# Altium schematic sheet _074_GSENSOR_KEY.SchDoc
size A1; SheetNumber: 1; SheetTotal: 1
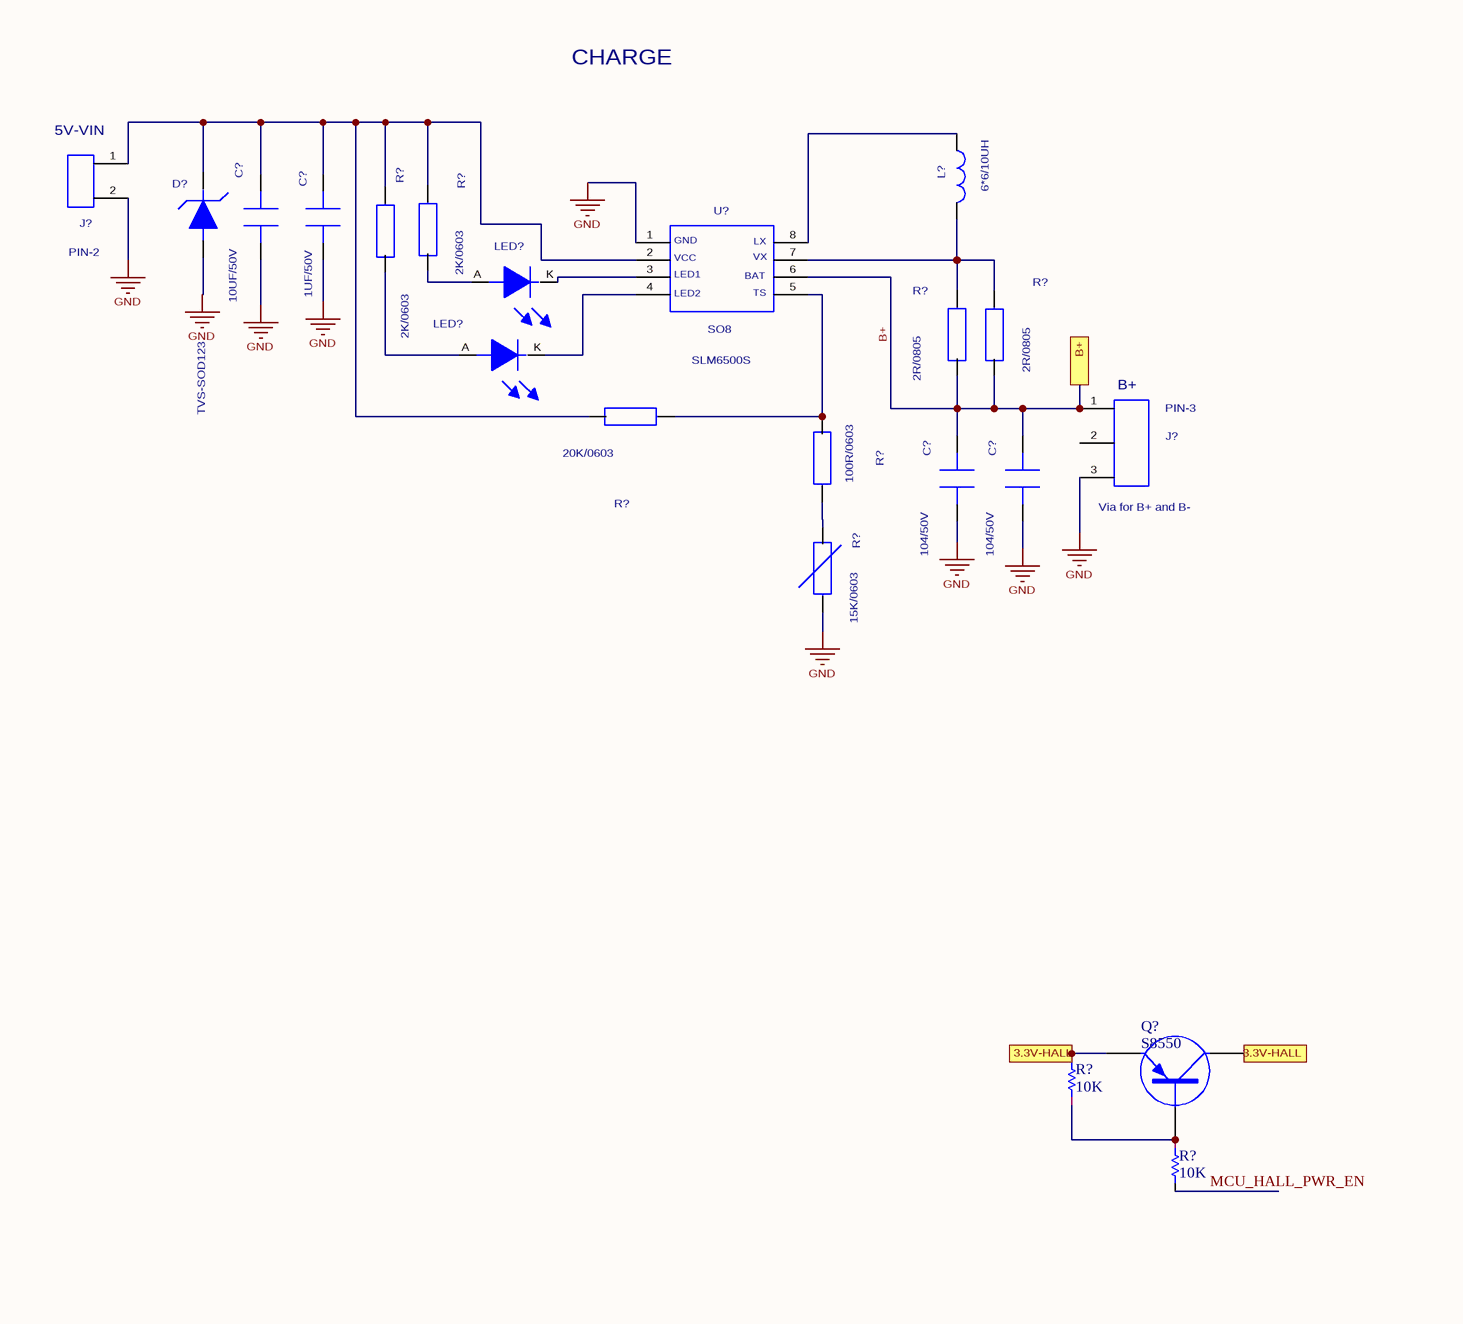
[diagram p0: _074_GSENSOR_KEY.SchDoc, top left]
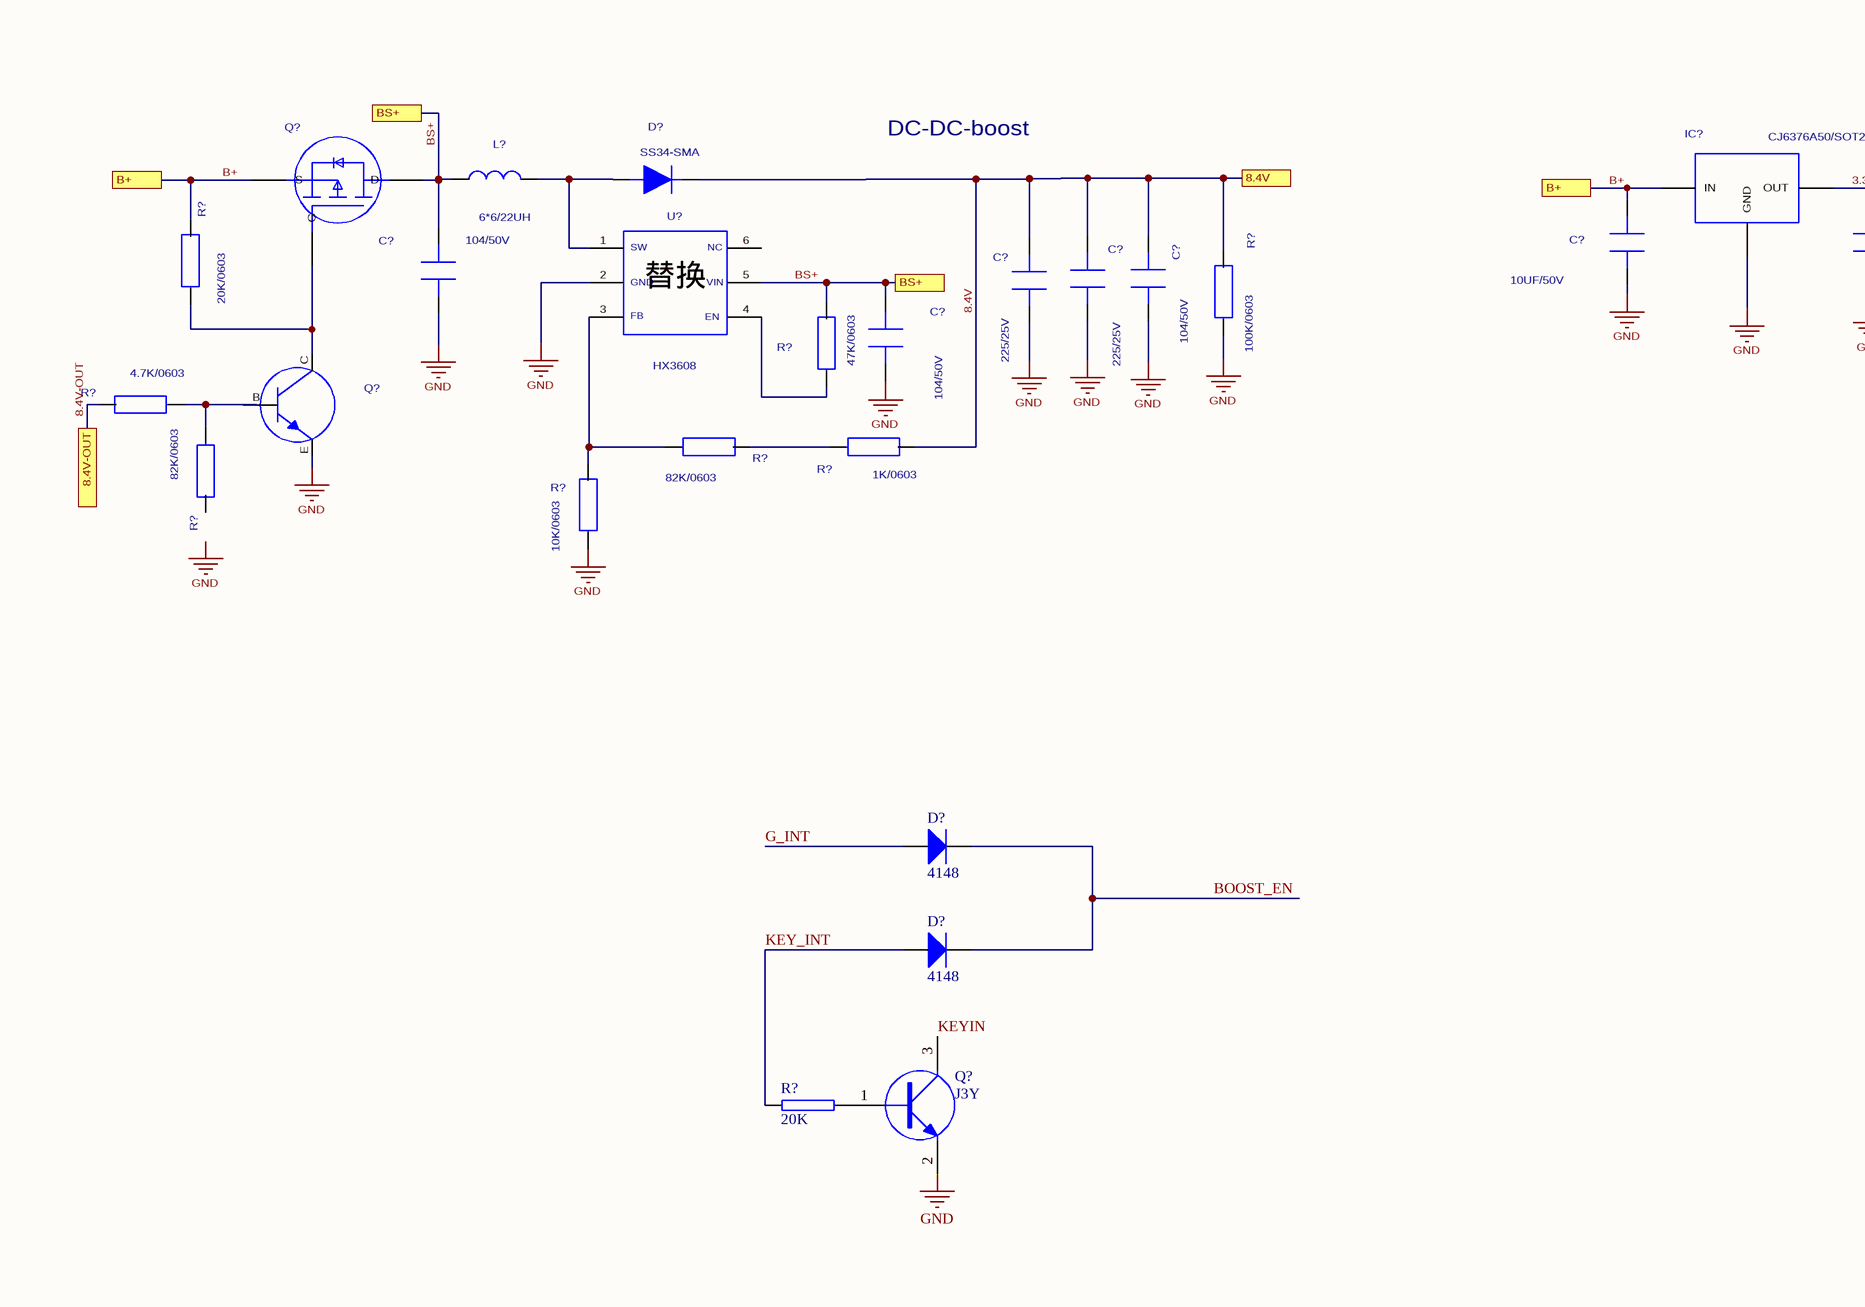
[diagram p1: _074_GSENSOR_KEY.SchDoc, top middle]
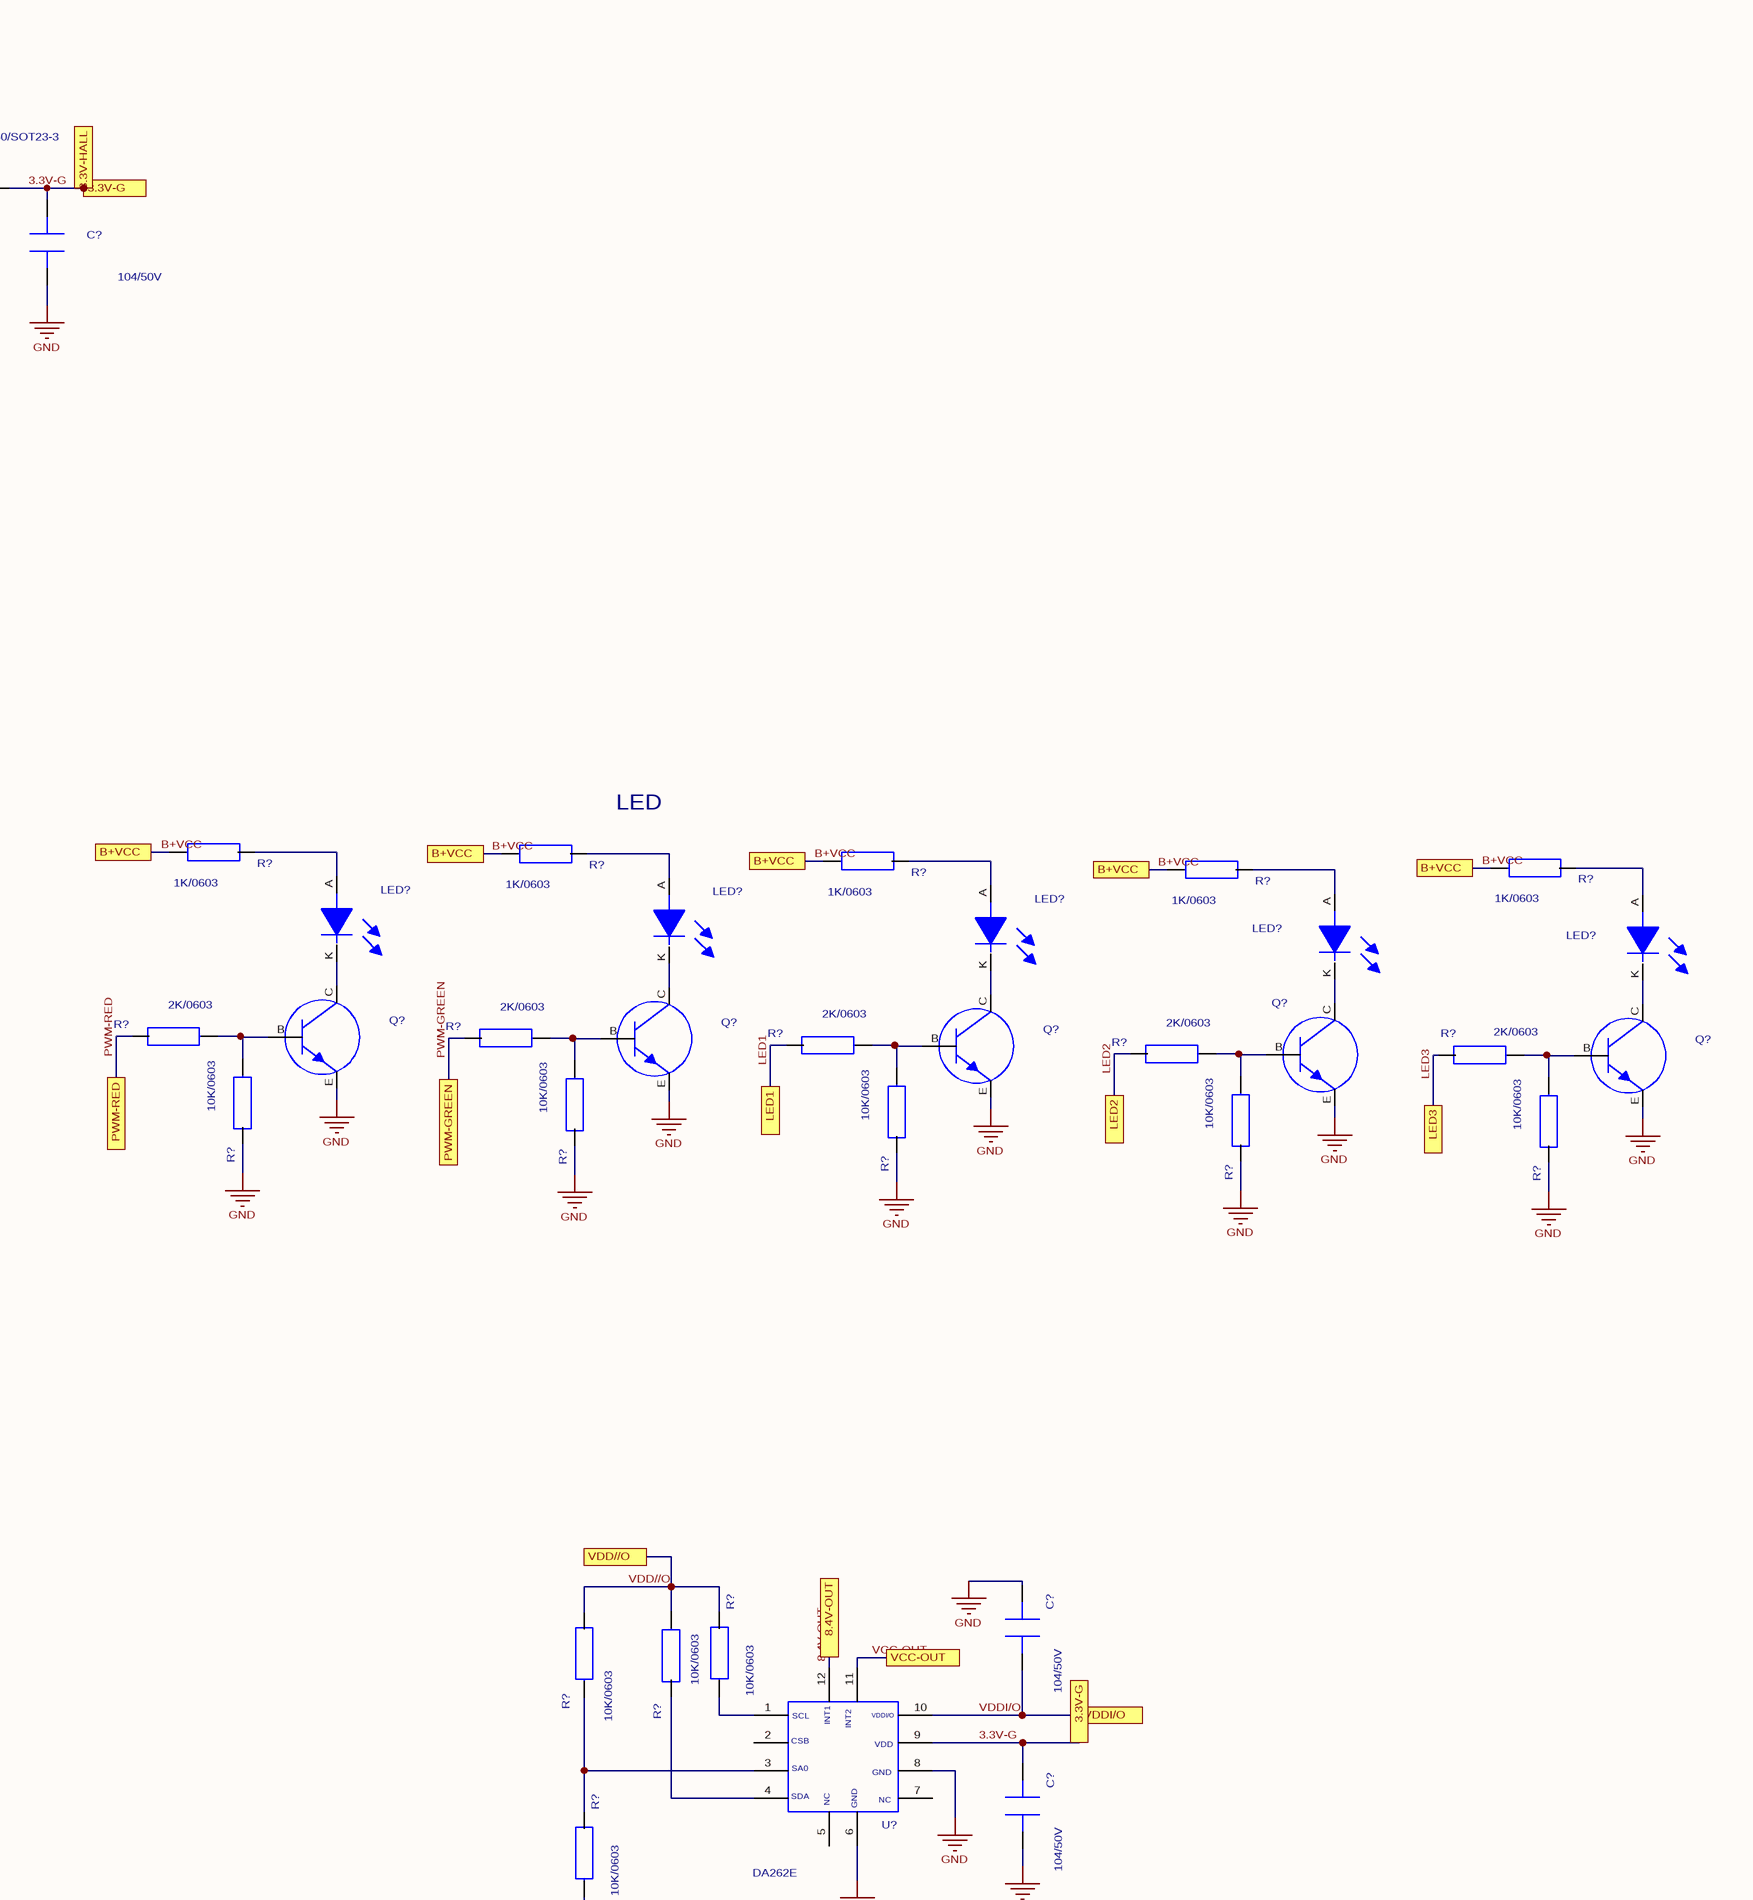
[diagram p2: _074_GSENSOR_KEY.SchDoc, top right]
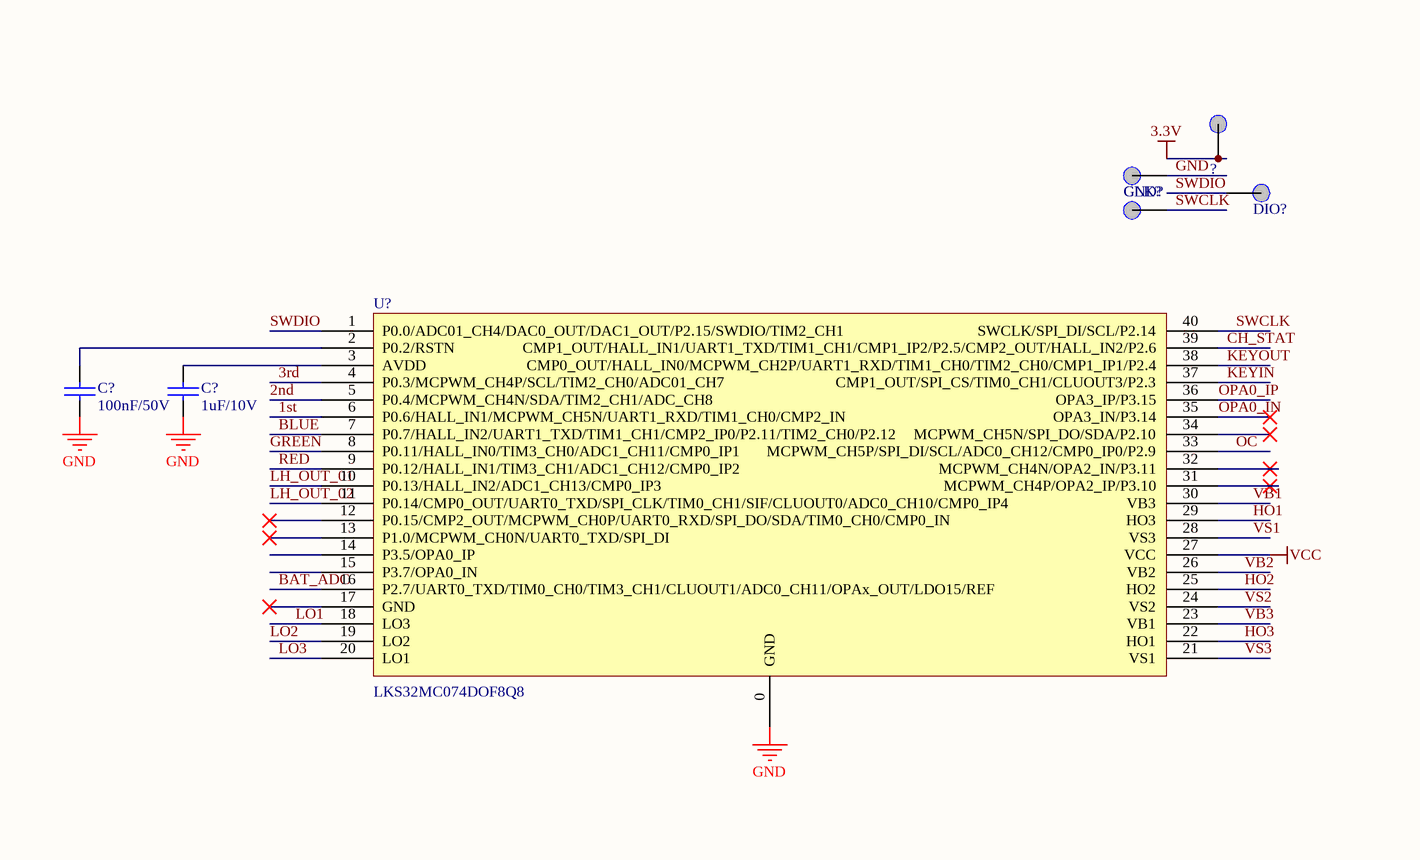
[diagram p3: _074_GSENSOR_KEY.SchDoc, bottom left]
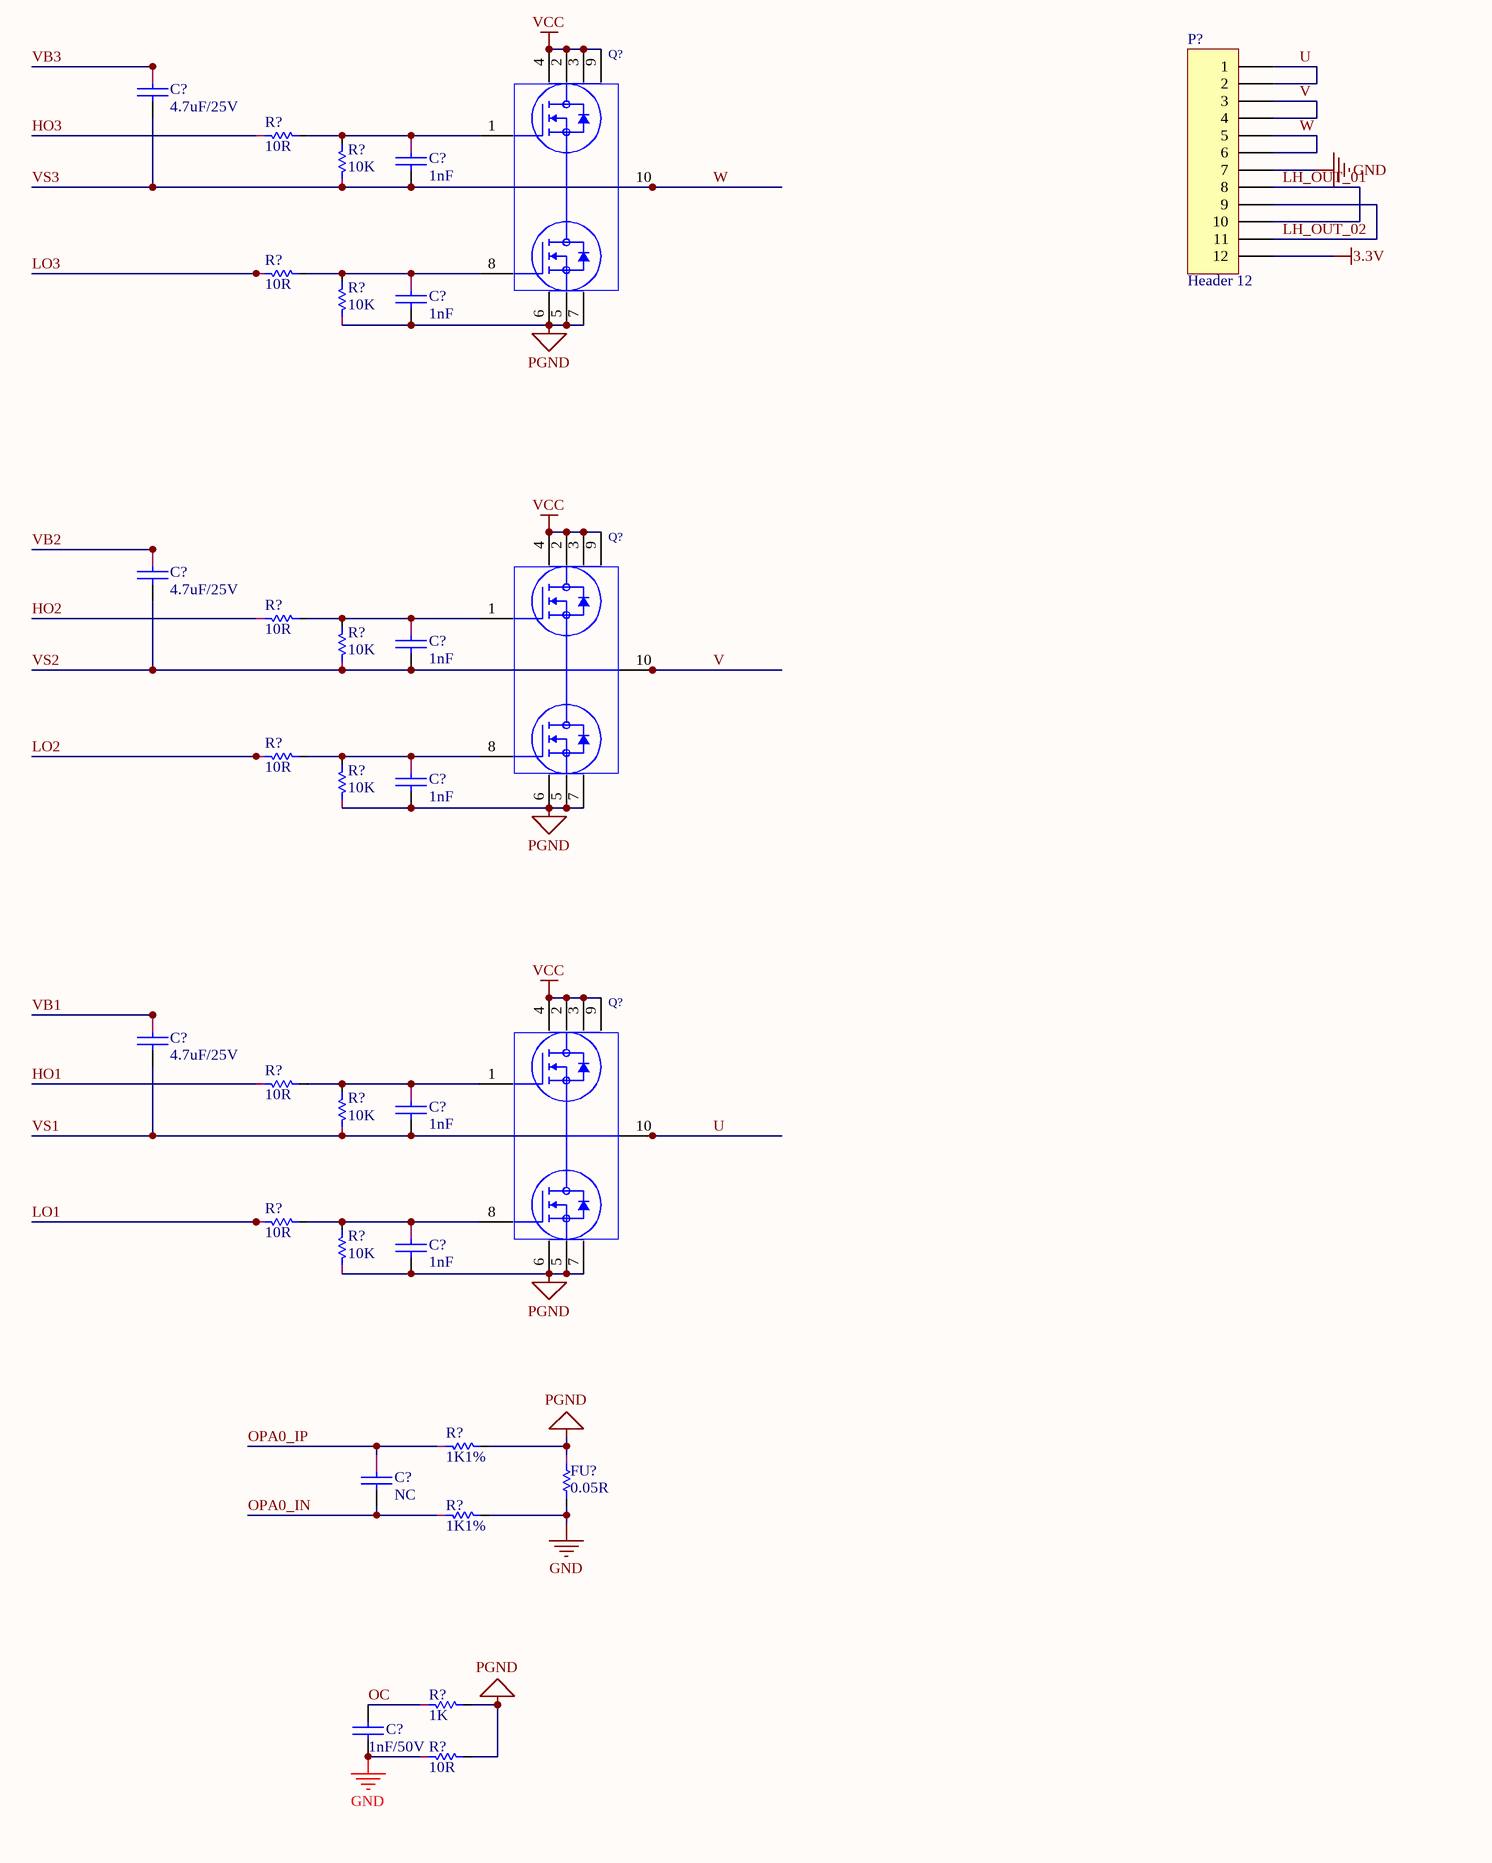
[diagram p4: _074_GSENSOR_KEY.SchDoc, bottom middle]
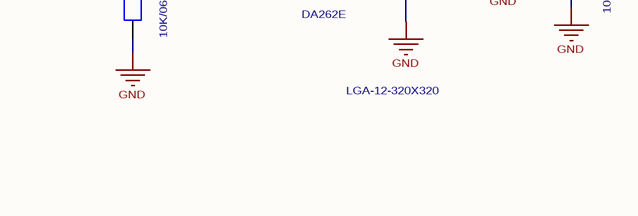
[diagram p5: _074_GSENSOR_KEY.SchDoc, bottom right]

## Parts
(Parts that share a designator on the sheet are numbered #1, #2 ... from top to bottom, then left to right.)
?  test  [piot]  (value not drawn)
C?#1  value 104/50V  [MICA1]  (hidden comment: CAPMICA1)
C?#2  value 10UF/50V  [MICA1]  (hidden comment: CAPMICA1)
C?#3  value 1UF/50V  [MICA1]  (hidden comment: CAPMICA1)
C?#4  value 10UF/50V  [MICA1]  (hidden comment: CAPMICA1)
C?#5  value 104/50V  [MICA1]  (hidden comment: CAPMICA1)
C?#6  value 225/25V  [MICA1]  (hidden comment: CAPMICA1)
C?#7  value 225/25V  [MICA1]  (hidden comment: CAPMICA1)
C?#8  value 104/50V  [MICA1]  (hidden comment: CAPMICA1)
C?#9  value 104/50V  [MICA1]  (hidden comment: CAPMICA1)
C?#10  value 104/50V  [MICA1]  (hidden comment: CAPMICA1)
C?#11  value 104/50V  [MICA1]  (hidden comment: CAPMICA1)
C?#12  value 104/50V  [MICA1]  (hidden comment: CAPMICA1)
C?#13  4.7uF/25V  [C 0402_M]
C?#14  1nF  [C 0402_M]
C?#15  value 104/50V  [MICA1]  (hidden comment: CAPMICA1)
C?#16  1nF  [C 0402_M]
C?#17  100nF/50V  [C 0402_M]
C?#18  1uF/10V  [C 0402_M]
C?#19  4.7uF/25V  [C 0402_M]
C?#20  1nF  [C 0402_M]
C?#21  1nF  [C 0402_M]
C?#22  4.7uF/25V  [C 0402_M]
C?#23  1nF  [C 0402_M]
C?#24  1nF  [C 0402_M]
C?#25  NC  [C 0402_M]
C?#26  1nF/50V  [C 0402_M]
CLK?  test  [piot]  (value not drawn)
D?#1  ZPD10  [DO35]  (value not drawn)
D?#2  value SS34-SMA  [DO7]  (hidden comment: DIODE)
D?#3  4148  [SOD-323]
D?#4  4148  [SOD-323]
DIO?  test  [piot]  (value not drawn)
FU?  0.05R  [R 0805_M]
GND?  test  [piot]  (value not drawn)
IC?  value CJ6376A50/SOT23-3  [TO-204AA]  (hidden comment: LM109K)
J?#1  PIN-2
J?#2  PIN-3
L?#1  value 6*6/22UH  [IND-MOLDED]  (hidden comment: IND-MOLDED)
L?#2  value 6*6/10UH  [IND-MOLDED]  (hidden comment: IND-MOLDED)
LED?#1  LED  [LED]  (value not drawn)
LED?#2  LED  [LED]  (value not drawn)
LED?#3  LED  [LED]  (value not drawn)
LED?#4  LED  [LED]  (value not drawn)
LED?#5  LED  [LED]  (value not drawn)
LED?#6  LED  [LED]  (value not drawn)
LED?#7  LED  [LED]  (value not drawn)
P?  Header 12  [SMD-12]
Q?#1  P-MOS01  [SOT23]  (value not drawn)
Q?#2  MM3001  [TO-39]  (value not drawn)
Q?#3  MM3001  [TO-39]  (value not drawn)
Q?#4  MM3001  [TO-39]  (value not drawn)
Q?#5  MM3001  [TO-39]  (value not drawn)
Q?#6  MM3001  [TO-39]  (value not drawn)
Q?#7  MM3001  [TO-39]  (value not drawn)
Q?#8  J3Y  [SOT-23]
Q?#9  S8550  [SOT23-3]
Q?#10  CJBM3020  [DFN-3X3_8]  (value not drawn)
Q?#11  CJBM3020  [DFN-3X3_8]  (value not drawn)
Q?#12  CJBM3020  [DFN-3X3_8]  (value not drawn)
R?#1  value 2K/0603  [R2W]  (hidden comment: RES-2W)
R?#2  value 2K/0603  [R2W]  (hidden comment: RES-2W)
R?#3  value 2R/0805  [R2W]  (hidden comment: RES-2W)
R?#4  value 2R/0805  [R2W]  (hidden comment: RES-2W)
R?#5  value 20K/0603  [R2W]  (hidden comment: RES-2W)
R?#6  value 100K/0603  [R2W]  (hidden comment: RES-2W)
R?#7  value 47K/0603  [R2W]  (hidden comment: RES-2W)
R?#8  value 4.7K/0603  [R2W]  (hidden comment: RES-2W)
R?#9  value 20K/0603  [R2W]  (hidden comment: RES-2W)
R?#10  value 82K/0603  [R2W]  (hidden comment: RES-2W)
R?#11  value 82K/0603  [R2W]  (hidden comment: RES-2W)
R?#12  value 1K/0603  [R2W]  (hidden comment: RES-2W)
R?#13  value 100R/0603  [R2W]  (hidden comment: RES-2W)
R?#14  value 10K/0603  [R2W]  (hidden comment: RES-2W)
R?#15  value 15K/0603  [R2W]  (hidden comment: RES-2W)
R?#16  value 1K/0603  [R2W]  (hidden comment: RES-2W)
R?#17  value 1K/0603  [R2W]  (hidden comment: RES-2W)
R?#18  value 1K/0603  [R2W]  (hidden comment: RES-2W)
R?#19  value 1K/0603  [R2W]  (hidden comment: RES-2W)
R?#20  value 1K/0603  [R2W]  (hidden comment: RES-2W)
R?#21  value 2K/0603  [R2W]  (hidden comment: RES-2W)
R?#22  value 2K/0603  [R2W]  (hidden comment: RES-2W)
R?#23  value 2K/0603  [R2W]  (hidden comment: RES-2W)
R?#24  10K  [R0402]
R?#25  value 10K/0603  [R2W]  (hidden comment: RES-2W)
R?#26  value 2K/0603  [R2W]  (hidden comment: RES-2W)
R?#27  value 2K/0603  [R2W]  (hidden comment: RES-2W)
R?#28  value 10K/0603  [R2W]  (hidden comment: RES-2W)
R?#29  value 10K/0603  [R2W]  (hidden comment: RES-2W)
R?#30  value 10K/0603  [R2W]  (hidden comment: RES-2W)
R?#31  value 10K/0603  [R2W]  (hidden comment: RES-2W)
R?#32  20K  [C 0402_M]
R?#33  10K  [R0402]
R?#34  value 10K/0603  [R2W]  (hidden comment: RES-2W)
R?#35  value 10K/0603  [R2W]  (hidden comment: RES-2W)
R?#36  value 10K/0603  [R2W]  (hidden comment: RES-2W)
R?#37  10R  [R 0402_M]
R?#38  10K  [R 0402_M]
R?#39  value 10K/0603  [R2W]  (hidden comment: RES-2W)
R?#40  10R  [R 0402_M]
R?#41  10K  [R 0402_M]
R?#42  10R  [R 0402_M]
R?#43  10K  [R 0402_M]
R?#44  10R  [R 0402_M]
R?#45  10K  [R 0402_M]
R?#46  10R  [R 0402_M]
R?#47  10K  [R 0402_M]
R?#48  10R  [R 0402_M]
R?#49  10K  [R 0402_M]
R?#50  1K1%  [R 0402_M]
R?#51  1K1%  [R 0402_M]
R?#52  1K  [R 0402_M]
R?#53  10R  [R 0402_M]
U?#1  SO8  value SLM6500S  [SO8NB]
U?#2  value HX3608  [SO6M1]  (hidden comment: SO6MM)
U?#3  LGA-12-320X320  value DA262E
U?#4  LKS32MC074DOF8Q8  [QFN40]

## Ports
3.3V-G, 3.3V-HALL, 8.4V, 8.4V-OUT, B+, B+VCC, BS+, LED1, LED2, LED3, PWM-GREEN, PWM-RED, VCC-OUT, VDD//O, VDDI/O

## Nets
3.3V: ?.1 P?.12
GND: C?#1.2 C?#2.1 C?#3.1 C?#4.1 C?#5.1 C?#6.1 C?#7.1 C?#8.1 C?#9.1 C?#10.1 C?#11.1 C?#12.2 C?#15.1 C?#17.2 C?#18.1 C?#26.1 D?#1.A FU?.1 GND?.1 IC?.3(GND) J?#1.2 J?#2.3 P?.7 Q?#2.E Q?#3.E Q?#4.E Q?#5.E Q?#6.E Q?#7.E Q?#8.2(E) R?#6.1 R?#14.1 R?#15.1 R?#25.2 R?#28.2 R?#29.2 R?#30.2 R?#31.2 R?#39.1 R?#51.1 R?#53.2 U?#1.1 U?#2.2 U?#3.6 U?#3.8 U?#4.0(GND)
PGND: C?#16.1 C?#21.1 C?#24.1 FU?.2 Q?#10.5(S2) Q?#10.6(S2) Q?#10.7(S2) Q?#11.5(S2) Q?#11.6(S2) Q?#11.7(S2) Q?#12.5(S2) Q?#12.6(S2) Q?#12.7(S2) R?#41.2 R?#45.2 R?#49.2 R?#50.1 R?#52.1 R?#53.1
VCC: Q?#10.2(D1) Q?#10.3(D1) Q?#10.4(D1) Q?#10.9(D1) Q?#11.2(D1) Q?#11.3(D1) Q?#11.4(D1) Q?#11.9(D1) Q?#12.2(D1) Q?#12.3(D1) Q?#12.4(D1) Q?#12.9(D1) U?#4.27(VCC)
1st: U?#4.6(P0.6/HALL_IN1/MCPWM_CH5N/UART1_RXD/TIM1_CH0/CMP2_IN)
2nd: U?#4.5(P0.4/MCPWM_CH4N/SDA/TIM2_CH1/ADC_CH8)
3.3V-G: C?#5.2 C?#15.2 IC?.2(OUT) Q?#9.2(E) Q?#9.3(C) R?#24.1 U?#3.9 ; port 3.3V-G, port 3.3V-HALL
3rd: U?#4.4(P0.3/MCPWM_CH4P/SCL/TIM2_CH0/ADC01_CH7)
8.4V: C?#6.2 C?#7.2 C?#8.2 D?#2.K R?#6.2 R?#12.2 ; port 8.4V
8.4V-OUT: R?#8.2 U?#3.12 ; port 8.4V-OUT
B+: C?#4.2 C?#10.2 C?#11.2 IC?.1(IN) J?#2.1 Q?#1.S R?#3.2 R?#4.2 R?#5.2 U?#1.6 ; port B+
B+VCC: R?#16.1 R?#17.1 R?#18.1 R?#19.1 R?#20.1 ; port B+VCC
BAT_ADC: U?#4.16(P2.7/UART0_TXD/TIM0_CH0/TIM3_CH1/CLUOUT1/ADC0_CH11/OPAx_OUT/LDO15/REF)
BLUE: U?#4.7(P0.7/HALL_IN2/UART1_TXD/TIM1_CH1/CMP2_IP0/P2.11/TIM2_CH0/P2.12)
BOOST_EN: D?#3.2(K) D?#4.2(K)
BS+: C?#1.1 C?#9.2 L?#1.2 Q?#1.D R?#7.2 U?#2.5 ; port BS+
CH_STAT: U?#4.39(CMP1_OUT/HALL_IN1/UART1_TXD/TIM1_CH1/CMP1_IP2/P2.5/CMP2_OUT/HALL_IN2/P2.6)
G_INT: D?#3.1(A)
GREEN: U?#4.8(P0.11/HALL_IN0/TIM3_CH0/ADC1_CH11/CMP0_IP1)
HO1: R?#46.2 U?#4.29(HO3)
HO2: R?#42.2 U?#4.25(HO2)
HO3: R?#37.2 U?#4.22(HO1)
KEY_INT: D?#4.1(A) R?#32.1
KEYIN: Q?#8.3(C) U?#4.37(CMP1_OUT/SPI_CS/TIM0_CH1/CLUOUT3/P2.3)
KEYOUT: U?#4.38(CMP0_OUT/HALL_IN0/MCPWM_CH2P/UART1_RXD/TIM1_CH0/TIM2_CH0/CMP1_IP1/P2.4)
LED1: R?#23.2 ; port LED1
LED2: R?#26.2 ; port LED2
LED3: R?#27.2 ; port LED3
LH_OUT_01: P?.8 P?.10 U?#4.10(P0.13/HALL_IN2/ADC1_CH13/CMP0_IP3)
LH_OUT_02: P?.9 P?.11 U?#4.11(P0.14/CMP0_OUT/UART0_TXD/SPI_CLK/TIM0_CH1/SIF/CLUOUT0/ADC0_CH10/CMP0_IP4)
LO1: R?#48.2 U?#4.18(LO3)
LO2: R?#44.2 U?#4.19(LO2)
LO3: R?#40.2 U?#4.20(LO1)
MCU_HALL_PWR_EN: R?#33.1
OC: C?#26.2 R?#52.2 U?#4.33(MCPWM_CH5P/SPI_DI/SCL/ADC0_CH12/CMP0_IP0/P2.9)
OPA0_IN: C?#25.1 R?#51.2 U?#4.35(OPA3_IN/P3.14)
OPA0_IP: C?#25.2 R?#50.2 U?#4.36(OPA3_IP/P3.15)
PWM-GREEN: R?#22.2 ; port PWM-GREEN
PWM-RED: R?#21.2 ; port PWM-RED
RED: U?#4.9(P0.12/HALL_IN1/TIM3_CH1/ADC1_CH12/CMP0_IP2)
SWCLK: CLK?.1 U?#4.40(SWCLK/SPI_DI/SCL/P2.14)
SWDIO: DIO?.1 U?#4.1(P0.0/ADC01_CH4/DAC0_OUT/DAC1_OUT/P2.15/SWDIO/TIM2_CH1)
U: C?#22.1 C?#23.1 P?.1 P?.2 Q?#12.10(S1/D2) R?#47.2 U?#4.28(VS3)  [also labelled VS1]
V: C?#19.1 C?#20.1 P?.3 P?.4 Q?#11.10(S1/D2) R?#43.2 U?#4.24(VS2)  [also labelled VS2]
VB1: C?#22.2 U?#4.30(VB3)
VB2: C?#19.2 U?#4.26(VB2)
VB3: C?#13.2 U?#4.23(VB1)
VCC-OUT: U?#3.11 ; port VCC-OUT
VDD//O: R?#34.1 R?#35.2 R?#36.2 ; port VDD//O
VDDI/O: C?#12.1 U?#3.10 ; port VDDI/O
VS3: C?#13.1 C?#14.1 P?.5 P?.6 Q?#10.10(S1/D2) R?#38.2 U?#4.21(VS1)  [also labelled W]
NetC?#2_2: C?#2.2 C?#3.2 D?#1.K J?#1.1 R?#1.1 R?#2.1 R?#9.2 U?#1.2
NetC?#14_2: C?#14.2 Q?#10.1(G1) R?#37.1 R?#38.1
NetC?#16_2: C?#16.2 Q?#10.8(G2) R?#40.1 R?#41.1
NetC?#17_1: C?#17.1 U?#4.2(P0.2/RSTN)
NetC?#18_2: C?#18.2 U?#4.3(AVDD)
NetC?#20_2: C?#20.2 Q?#11.1(G1) R?#42.1 R?#43.1
NetC?#21_2: C?#21.2 Q?#11.8(G2) R?#44.1 R?#45.1
NetC?#23_2: C?#23.2 Q?#12.1(G1) R?#46.1 R?#47.1
NetC?#24_2: C?#24.2 Q?#12.8(G2) R?#48.1 R?#49.1
NetD?#2_A: D?#2.A L?#1.1 U?#2.1
NetL?#2_1: L?#2.1 R?#3.1 R?#4.1 U?#1.7
NetL?#2_2: L?#2.2 U?#1.8
NetLED?#1_A: LED?#1.A R?#2.2
NetLED?#1_K: LED?#1.K U?#1.3
NetLED?#2_A: LED?#2.A R?#1.2
NetLED?#2_K: LED?#2.K U?#1.4
NetLED?#3_A: LED?#3.A R?#16.2
NetLED?#3_K: LED?#3.K Q?#3.C
NetLED?#4_A: LED?#4.A R?#17.2
NetLED?#4_K: LED?#4.K Q?#4.C
NetLED?#5_A: LED?#5.A R?#18.2
NetLED?#5_K: LED?#5.K Q?#5.C
NetLED?#6_A: LED?#6.A R?#20.2
NetLED?#6_K: LED?#6.K Q?#6.C
NetLED?#7_A: LED?#7.A R?#19.2
NetLED?#7_K: LED?#7.K Q?#7.C
NetQ?#1_G: Q?#1.G Q?#2.C R?#5.1
NetQ?#2_B: Q?#2.B R?#8.1 R?#10.1
NetQ?#3_B: Q?#3.B R?#21.1 R?#25.1
NetQ?#4_B: Q?#4.B R?#22.1 R?#28.1
NetQ?#5_B: Q?#5.B R?#23.1 R?#29.1
NetQ?#6_B: Q?#6.B R?#26.1 R?#30.1
NetQ?#7_B: Q?#7.B R?#27.1 R?#31.1
NetQ?#8_1: Q?#8.1(B) R?#32.2
NetQ?#9_1: Q?#9.1(B) R?#24.2 R?#33.2
NetR?#7_1: R?#7.1 U?#2.4
NetR?#9_1: R?#9.1 R?#13.2 U?#1.5
NetR?#11_1: R?#11.1 R?#14.2 U?#2.3
NetR?#11_2: R?#11.2 R?#12.1
NetR?#13_1: R?#13.1 R?#15.2
NetR?#34_2: R?#34.2 U?#3.4
NetR?#35_1: R?#35.1 R?#39.2 U?#3.3
NetR?#36_1: R?#36.1 U?#3.1

Not connected (* = marked no-connect by the designer): J?#2 2; R?#10 2; U?#2 6; U?#3 2 5 7; U?#4 12(P0.15/CMP2_OUT/MCPWM_CH0P/UART0_RXD/SPI_DO/SDA/TIM0_CH0/CMP0_IN)* 13(P1.0/MCPWM_CH0N/UART0_TXD/SPI_DI)* 14(P3.5/OPA0_IP) 15(P3.7/OPA0_IN) 17(GND)* 31(MCPWM_CH4P/OPA2_IP/P3.10)* 32(MCPWM_CH4N/OPA2_IN/P3.11)* 34(MCPWM_CH5N/SPI_DO/SDA/P2.10)*

## Notes on the sheet
- CHARGE
- (near J?#1) 5V-VIN
- DC-DC-boost
- (near U?#1) GND
- (near U?#1) VCC
- (near U?#1) LED1
- (near U?#1) BAT
- (near U?#1) VX
- (near U?#1) LX
- (near U?#2) SW
- (near U?#2) NC
- (near U?#1) LED2
- (near U?#1) TS
- (near U?#2) FB
- (near U?#2) GND
- (near U?#2) 替换
- (near U?#2) EN
- (near U?#2) VIN
- TVS-SOD123
- (near J?#2) B+
- (near J?#2) Via for B+ and B-
- LED
- (near U?#3) CSB
- (near U?#3) SCL
- (near U?#3) INT1
- (near U?#3) INT2
- (near U?#3) VDD
- (near U?#3) VDDI/O
- (near U?#3) SDA
- (near U?#3) SA0
- (near U?#3) NC
- (near U?#3) GND
- Labels drawn without touching a wire or pin: GND

## Library data of the parts
C?#1-C?#12 C?#15 = CAPMICA1: MICA TANTALUM CAPACITOR 5.69 X 10.9 MM; Manufacturer #1: IPC SM-782 STD.; PCB DECAL: MICA1
C?#13 C?#14 C?#16 C?#19-C?#25 = CAP: Capacitor
C?#17 C?#18 C?#26 = C: Capacitor
D?#1 = ZPD10: ZENER VOLTAGE REGULATOR DIODE, VZ=10V; Manufacturer #1: MOTOROLA; Part Number: ZPD10; PCB DECAL: DO35
D?#2 = DIODE: GENERIC DIODE W ALTERNATE; PCB DECAL: DO7
D?#3 D?#4 = Diode: Default Diode; Published: 8-Jun-2000; LatestRevisionDate: 17-Jul-2002; LatestRevisionNote: Re-released for DXP Platform.; PackageDocument: Sep-1996; PackageReference: SMC; Publisher: Altium Limited; Code_JEDEC: DO-214-AB
FU? R?#24 R?#33 R?#37 R?#38 R?#40-R?#53 = RAS
IC? = LM109K: POSITIVE VOLTAGE REGULATOR; FIXED +5VOLTS; Part Number: LM109 (K,H); Manufacturer #1: MOTOROLA; PCB DECAL: TO-204AA
L?#1 L?#2 = IND-MOLDED: MOLDED INDUCTOR, 0.5" PIN SPACING; PCB DECAL: IND-MOLDED
LED?#1-LED?#7 = LED: LIGHT EMITTING DIODE; Sim.Analog.Order: Model$; Sim.Analog.Prefix: D; Color: ???; PCB DECAL: LED
P? = Header 12: Header, 12-Pin; LatestRevisionDate: 17-Jul-2002; LatestRevisionNote: Re-released for DXP Platform.; Publisher: Altium Limited
Q?#1 = P-MOS01: N-CHANNEL,ENHANCEMENT MODE, TMOS FET; Part Number: MMBF170LT1; Manufacturer #1: MOTOROLA; Value: 10N65; PCB DECAL: SOT23
Q?#2-Q?#7 = MM3001: GENERAL PURPOSE NPN SILICON TRANSISTOR; Manufacturer #1: MOTOROLA; Part Number: MM3001; PCB DECAL: TO-39
Q?#8 = NPN: NPN Transistor
Q?#9 = PNP-BEC: PNP Transistor
R?#1-R?#23 R?#25-R?#31 R?#34-R?#36 R?#39 = RES-2W: RES  BODY:340  CENTERS:1000; Part Number: R7; PCB DECAL: R2W
R?#32 = RES2_S
U?#1 = SO8: GENERIC 8 PIN SMT; PCB DECAL: SO8NB
U?#2 = SO6MM: GENERIC 6 PIN SMT METRIC; PCB DECAL: SO6M1
U?#4 = LKS32MC074DF8Q8: 芯片
Q?#10-Q?#12 = CJBM3020: PCB DECAL: DFN-3X3_8